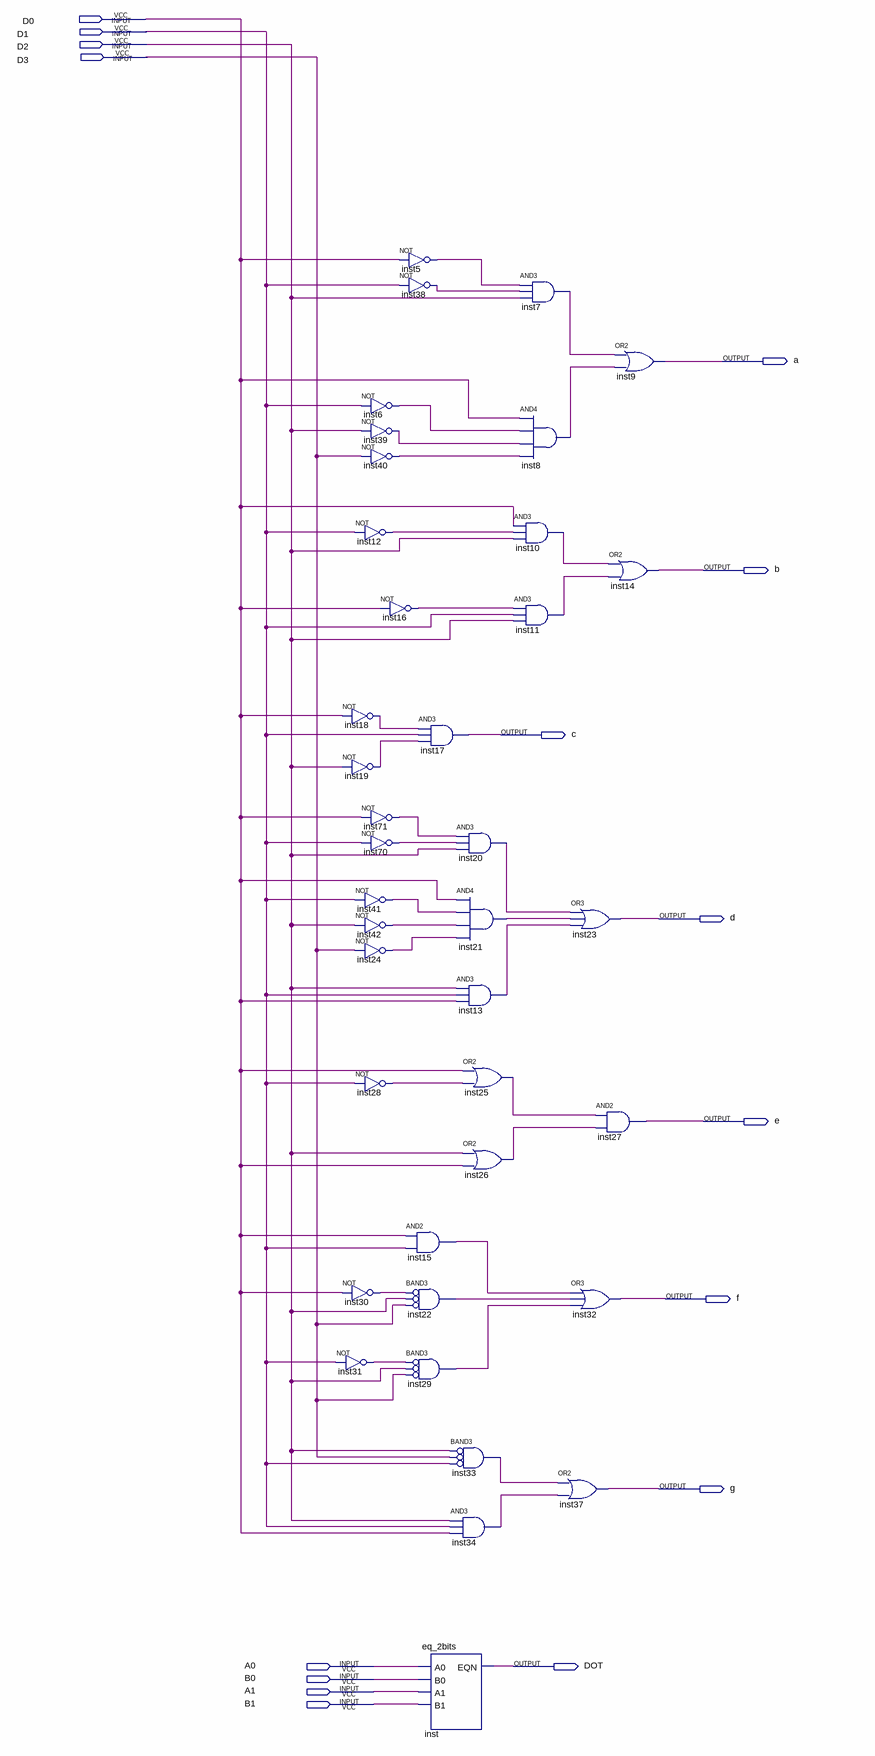
[diagram p0: schematic sheet]
// Quartus schematic seven_seg.bdf as structural Verilog: 39 symbols, 16 pins
module seven_seg (
  input  D0,
  input  D1,
  input  D2,
  input  D3,
  input  A0,
  input  B0,
  input  A1,
  input  B1,
  output a,
  output b,
  output c,
  output d,
  output e,
  output f,
  output g,
  output DOT
);

  wire inst5_out, inst6_out, inst7_out, inst8_out, inst10_out, inst11_out, inst12_out, inst13_out,
       inst15_out, inst16_out, inst18_out, inst19_out, inst20_out, inst21_out, inst22_out, inst24_out,
       inst25_out, inst26_out, inst28_out, inst29_out, inst30_out, inst31_out, inst33_out, inst34_out,
       inst38_out, inst39_out, inst40_out, inst41_out, inst42_out, inst70_out, inst71_out;

  not inst6 (inst6_out, D1);
  not inst39 (inst39_out, D2);
  not inst40 (inst40_out, D3);
  not inst12 (inst12_out, D1);
  not inst18 (inst18_out, D0);
  not inst19 (inst19_out, D2);
  not inst71 (inst71_out, D0);
  not inst70 (inst70_out, D1);
  not inst41 (inst41_out, D1);
  not inst42 (inst42_out, D2);
  not inst24 (inst24_out, D3);
  not inst28 (inst28_out, D1);
  not inst30 (inst30_out, D0);
  not inst31 (inst31_out, D1);
  not inst5 (inst5_out, D0);
  not inst38 (inst38_out, D1);
  not inst16 (inst16_out, D0);
  and inst17 (c, inst18_out, D1, inst19_out);
  and inst15 (inst15_out, D0, D1);
  and inst22 (inst22_out, ~inst30_out, ~D2, ~D3);  // BAND3
  and inst29 (inst29_out, ~inst31_out, ~D2, ~D3);  // BAND3
  eq_2bits inst (.A0(A0), .B0(B0), .A1(A1), .B1(B1), .EQN(DOT));
  and inst20 (inst20_out, inst71_out, inst70_out, D2);
  and inst21 (inst21_out, D0, inst41_out, inst42_out, inst24_out);
  and inst13 (inst13_out, D2, D1, D0);
  or inst25 (inst25_out, D0, inst28_out);
  or inst26 (inst26_out, D2, D0);
  and inst33 (inst33_out, ~D2, ~D3, ~D1);  // BAND3
  and inst34 (inst34_out, D2, D1, D0);
  and inst7 (inst7_out, inst5_out, inst38_out, D2);
  and inst8 (inst8_out, D0, inst6_out, inst39_out, inst40_out);
  and inst10 (inst10_out, D0, inst12_out, D2);
  and inst11 (inst11_out, inst16_out, D1, D2);
  or inst23 (d, inst20_out, inst21_out, inst13_out);
  or inst32 (f, inst15_out, inst22_out, inst29_out);
  or inst37 (g, inst33_out, inst34_out);
  or inst9 (a, inst7_out, inst8_out);
  or inst14 (b, inst10_out, inst11_out);
  and inst27 (e, inst25_out, inst26_out);
endmodule
